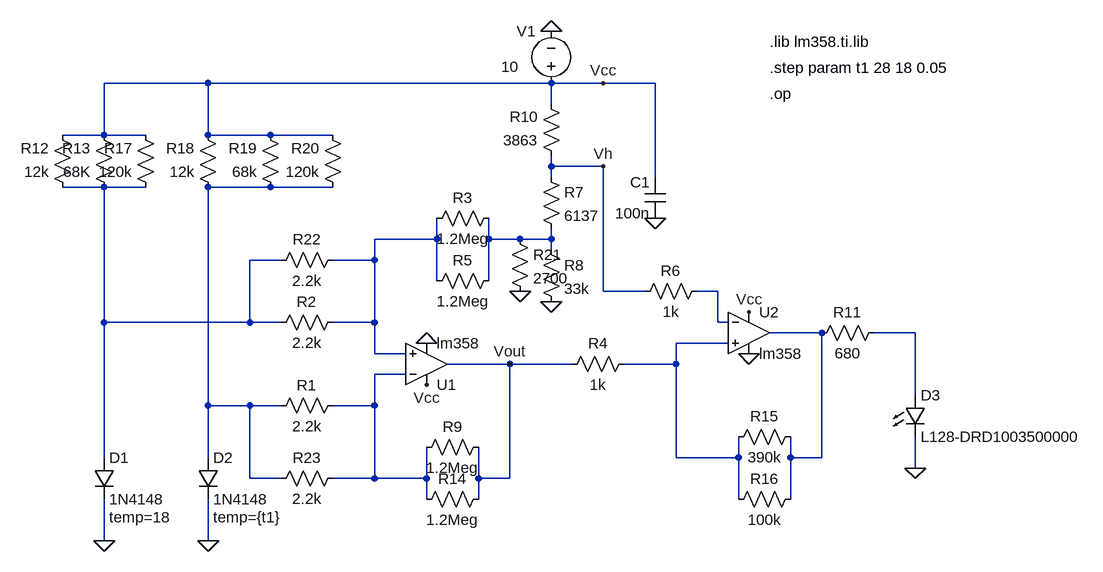
[diagram p0: schematic lab1 t.asc]
lab1 t.asc, the LTspice schematic file:
Version 4
SHEET 1 2512 680
WIRE -96 -416 -256 -416
WIRE 432 -416 -96 -416
WIRE 512 -416 432 -416
WIRE 592 -416 512 -416
WIRE 432 -384 432 -416
WIRE -256 -336 -256 -416
WIRE -256 -336 -320 -336
WIRE -192 -336 -256 -336
WIRE -96 -336 -96 -416
WIRE 0 -336 -96 -336
WIRE 96 -336 0 -336
WIRE 432 -288 432 -304
WIRE 512 -288 432 -288
WIRE 432 -272 432 -288
WIRE 592 -272 592 -416
WIRE -256 -256 -320 -256
WIRE -192 -256 -256 -256
WIRE 0 -256 -96 -256
WIRE 96 -256 0 -256
WIRE 256 -176 256 -208
WIRE 256 -176 160 -176
WIRE 336 -176 336 -208
WIRE 384 -176 336 -176
WIRE 432 -176 432 -192
WIRE 432 -176 384 -176
WIRE 432 -160 432 -176
WIRE 16 -144 -32 -144
WIRE 160 -144 160 -176
WIRE 160 -144 96 -144
WIRE 256 -112 256 -176
WIRE 336 -112 336 -176
WIRE 512 -96 512 -288
WIRE 576 -96 512 -96
WIRE 688 -96 656 -96
WIRE -256 -48 -256 -256
WIRE -32 -48 -32 -144
WIRE -32 -48 -256 -48
WIRE 16 -48 -32 -48
WIRE 160 -48 160 -144
WIRE 160 -48 96 -48
WIRE 688 -48 688 -96
WIRE 704 -48 688 -48
WIRE 848 -32 768 -32
WIRE 992 -32 928 -32
WIRE 704 -16 624 -16
WIRE 160 0 160 -48
WIRE 208 0 160 0
WIRE 368 16 272 16
WIRE 464 16 368 16
WIRE 624 16 624 -16
WIRE 624 16 544 16
WIRE 208 32 160 32
WIRE 992 64 992 -32
WIRE -96 80 -96 -256
WIRE -32 80 -96 80
WIRE 16 80 -32 80
WIRE 160 80 160 32
WIRE 160 80 96 80
WIRE -256 160 -256 -48
WIRE -96 160 -96 80
WIRE 624 160 624 16
WIRE 720 160 720 128
WIRE 720 160 624 160
WIRE 800 160 800 128
WIRE 848 160 848 -32
WIRE 848 160 800 160
WIRE 992 176 992 128
WIRE -32 192 -32 80
WIRE 16 192 -32 192
WIRE 160 192 160 80
WIRE 160 192 96 192
WIRE 240 192 240 144
WIRE 240 192 160 192
WIRE 320 192 320 144
WIRE 368 192 368 16
WIRE 368 192 320 192
WIRE 240 224 240 192
WIRE 320 224 320 192
WIRE 720 224 720 160
WIRE 800 224 800 160
WIRE -256 288 -256 224
WIRE -96 288 -96 224
FLAG 432 -80 0
FLAG 240 -16 0
FLAG 592 -208 0
FLAG 512 -416 Vcc
FLAG 240 48 Vcc
FLAG -256 288 0
FLAG -96 288 0
FLAG 432 -496 0
FLAG 736 -64 Vcc
FLAG 736 0 0
FLAG 992 176 0
FLAG 384 -96 0
FLAG 368 16 Vout
FLAG 512 -288 Vh
SYMBOL diode -272 160 R0
WINDOW 123 24 92 Left 2
SYMATTR Value2 temp=18
SYMATTR InstName D1
SYMATTR Value 1N4148
SYMBOL diode -112 160 R0
WINDOW 123 24 92 Left 2
SYMATTR Value2 temp={t1}
SYMATTR InstName D2
SYMATTR Value 1N4148
SYMBOL res 112 64 R90
WINDOW 0 0 56 VBottom 2
WINDOW 3 32 56 VTop 2
SYMATTR InstName R1
SYMATTR Value 2.2k
SYMBOL res 112 -64 R90
WINDOW 0 0 56 VBottom 2
WINDOW 3 32 56 VTop 2
SYMATTR InstName R2
SYMATTR Value 2.2k
SYMBOL res 560 0 R90
WINDOW 0 0 56 VBottom 2
WINDOW 3 32 56 VTop 2
SYMATTR InstName R4
SYMATTR Value 1k
SYMBOL res 560 -80 R270
WINDOW 0 32 56 VTop 2
WINDOW 3 0 56 VBottom 2
SYMATTR InstName R6
SYMATTR Value 1k
SYMBOL res 416 -288 R0
SYMATTR InstName R7
SYMATTR Value 6137
SYMBOL res 416 -176 R0
SYMATTR InstName R8
SYMATTR Value 33k
SYMBOL cap 608 -208 R180
WINDOW 0 24 56 Left 2
WINDOW 3 24 8 Left 2
SYMATTR InstName C1
SYMATTR Value 100n
SYMBOL res 448 -288 R180
WINDOW 0 36 76 Left 2
WINDOW 3 36 40 Left 2
SYMATTR InstName R10
SYMATTR Value 3863
SYMBOL OpAmps\\opamp2 240 80 M180
SYMATTR InstName U1
SYMATTR Value lm358
SYMBOL voltage 432 -400 R180
WINDOW 0 24 96 Left 2
WINDOW 3 50 41 Left 2
WINDOW 123 0 0 Left 0
WINDOW 39 0 0 Left 0
SYMATTR InstName V1
SYMATTR Value 10
SYMBOL res 944 -48 R90
WINDOW 0 0 56 VBottom 2
WINDOW 3 32 56 VTop 2
SYMATTR InstName R11
SYMATTR Value 680
SYMBOL OpAmps\\opamp2 736 -96 R0
SYMATTR InstName U2
SYMATTR Value lm358
SYMBOL LED 976 64 R0
SYMATTR InstName D3
SYMATTR Value L128-DRD1003500000
SYMBOL res 352 -224 R90
WINDOW 0 0 56 VBottom 2
WINDOW 3 32 56 VTop 2
SYMATTR InstName R3
SYMATTR Value 1.2Meg
SYMBOL res 352 -128 R90
WINDOW 0 0 56 VBottom 2
WINDOW 3 32 56 VTop 2
SYMATTR InstName R5
SYMATTR Value 1.2Meg
SYMBOL res 336 128 R90
WINDOW 0 0 56 VBottom 2
WINDOW 3 32 56 VTop 2
SYMATTR InstName R9
SYMATTR Value 1.2Meg
SYMBOL res 336 208 R90
WINDOW 0 0 56 VBottom 2
WINDOW 3 32 56 VTop 2
SYMATTR InstName R14
SYMATTR Value 1.2Meg
SYMBOL res 816 112 R90
WINDOW 0 0 56 VBottom 2
WINDOW 3 32 56 VTop 2
SYMATTR InstName R15
SYMATTR Value 390k
SYMBOL res 816 208 R90
WINDOW 0 0 56 VBottom 2
WINDOW 3 32 56 VTop 2
SYMATTR InstName R16
SYMATTR Value 100k
SYMBOL res -304 -240 R180
WINDOW 0 36 76 Left 2
WINDOW 3 36 40 Left 2
SYMATTR InstName R12
SYMATTR Value 12k
SYMBOL res -240 -240 R180
WINDOW 0 36 76 Left 2
WINDOW 3 36 40 Left 2
SYMATTR InstName R13
SYMATTR Value 68K
SYMBOL res -176 -240 R180
WINDOW 0 36 76 Left 2
WINDOW 3 36 40 Left 2
SYMATTR InstName R17
SYMATTR Value 120k
SYMBOL res -80 -240 R180
WINDOW 0 36 76 Left 2
WINDOW 3 36 40 Left 2
SYMATTR InstName R18
SYMATTR Value 12k
SYMBOL res 16 -240 R180
WINDOW 0 36 76 Left 2
WINDOW 3 36 40 Left 2
SYMATTR InstName R19
SYMATTR Value 68k
SYMBOL res 112 -240 R180
WINDOW 0 36 76 Left 2
WINDOW 3 36 40 Left 2
SYMATTR InstName R20
SYMATTR Value 120k
SYMBOL res 368 -192 R0
SYMATTR InstName R21
SYMATTR Value 2700
SYMBOL res 112 -160 R90
WINDOW 0 0 56 VBottom 2
WINDOW 3 32 56 VTop 2
SYMATTR InstName R22
SYMATTR Value 2.2k
SYMBOL res 112 176 R90
WINDOW 0 0 56 VBottom 2
WINDOW 3 32 56 VTop 2
SYMATTR InstName R23
SYMATTR Value 2.2k
TEXT 768 -480 Left 2 !.lib lm358.ti.lib
TEXT 768 -440 Left 2 !.step param t1 28 18 0.05
TEXT 768 -400 Left 2 !.op

The netlist it stands for:
* lab1 t.asc
D1 N001 0 1N4148 temp=18
D2 N002 0 1N4148 temp={t1}
R1 N009 N002 2.2k
R2 N003 N001 2.2k
R4 N008 Vout 1k
R6 Vh N005 1k
R7 Vh N004 6137
R8 N004 0 33k
C1 0 Vcc 100n
R10 Vh Vcc 3863
XU1 N003 N009 Vcc 0 Vout lm358  ; pins In+ In- V+ V- OUT
V1 Vcc 0 10
R11 N007 N006 680
XU2 N008 N005 Vcc 0 N006 lm358  ; pins In+ In- V+ V- OUT
D3 N007 0 L128-DRD1003500000
R3 N004 N003 1.2Meg
R5 N004 N003 1.2Meg
R9 Vout N009 1.2Meg
R14 Vout N009 1.2Meg
R15 N006 N008 390k
R16 N006 N008 100k
R12 N001 Vcc 12k
R13 N001 Vcc 68K
R17 N001 Vcc 120k
R18 N002 Vcc 12k
R19 N002 Vcc 68k
R20 N002 Vcc 120k
R21 N004 0 2700
R22 N003 N001 2.2k
R23 N009 N002 2.2k
.model D D
.lib standard.dio
.lib lm358.ti.lib
.step param t1 28 18 0.05
.op
.backanno
.end